# EAGLE schematic ABS converter (EAGLE 9.4.2)
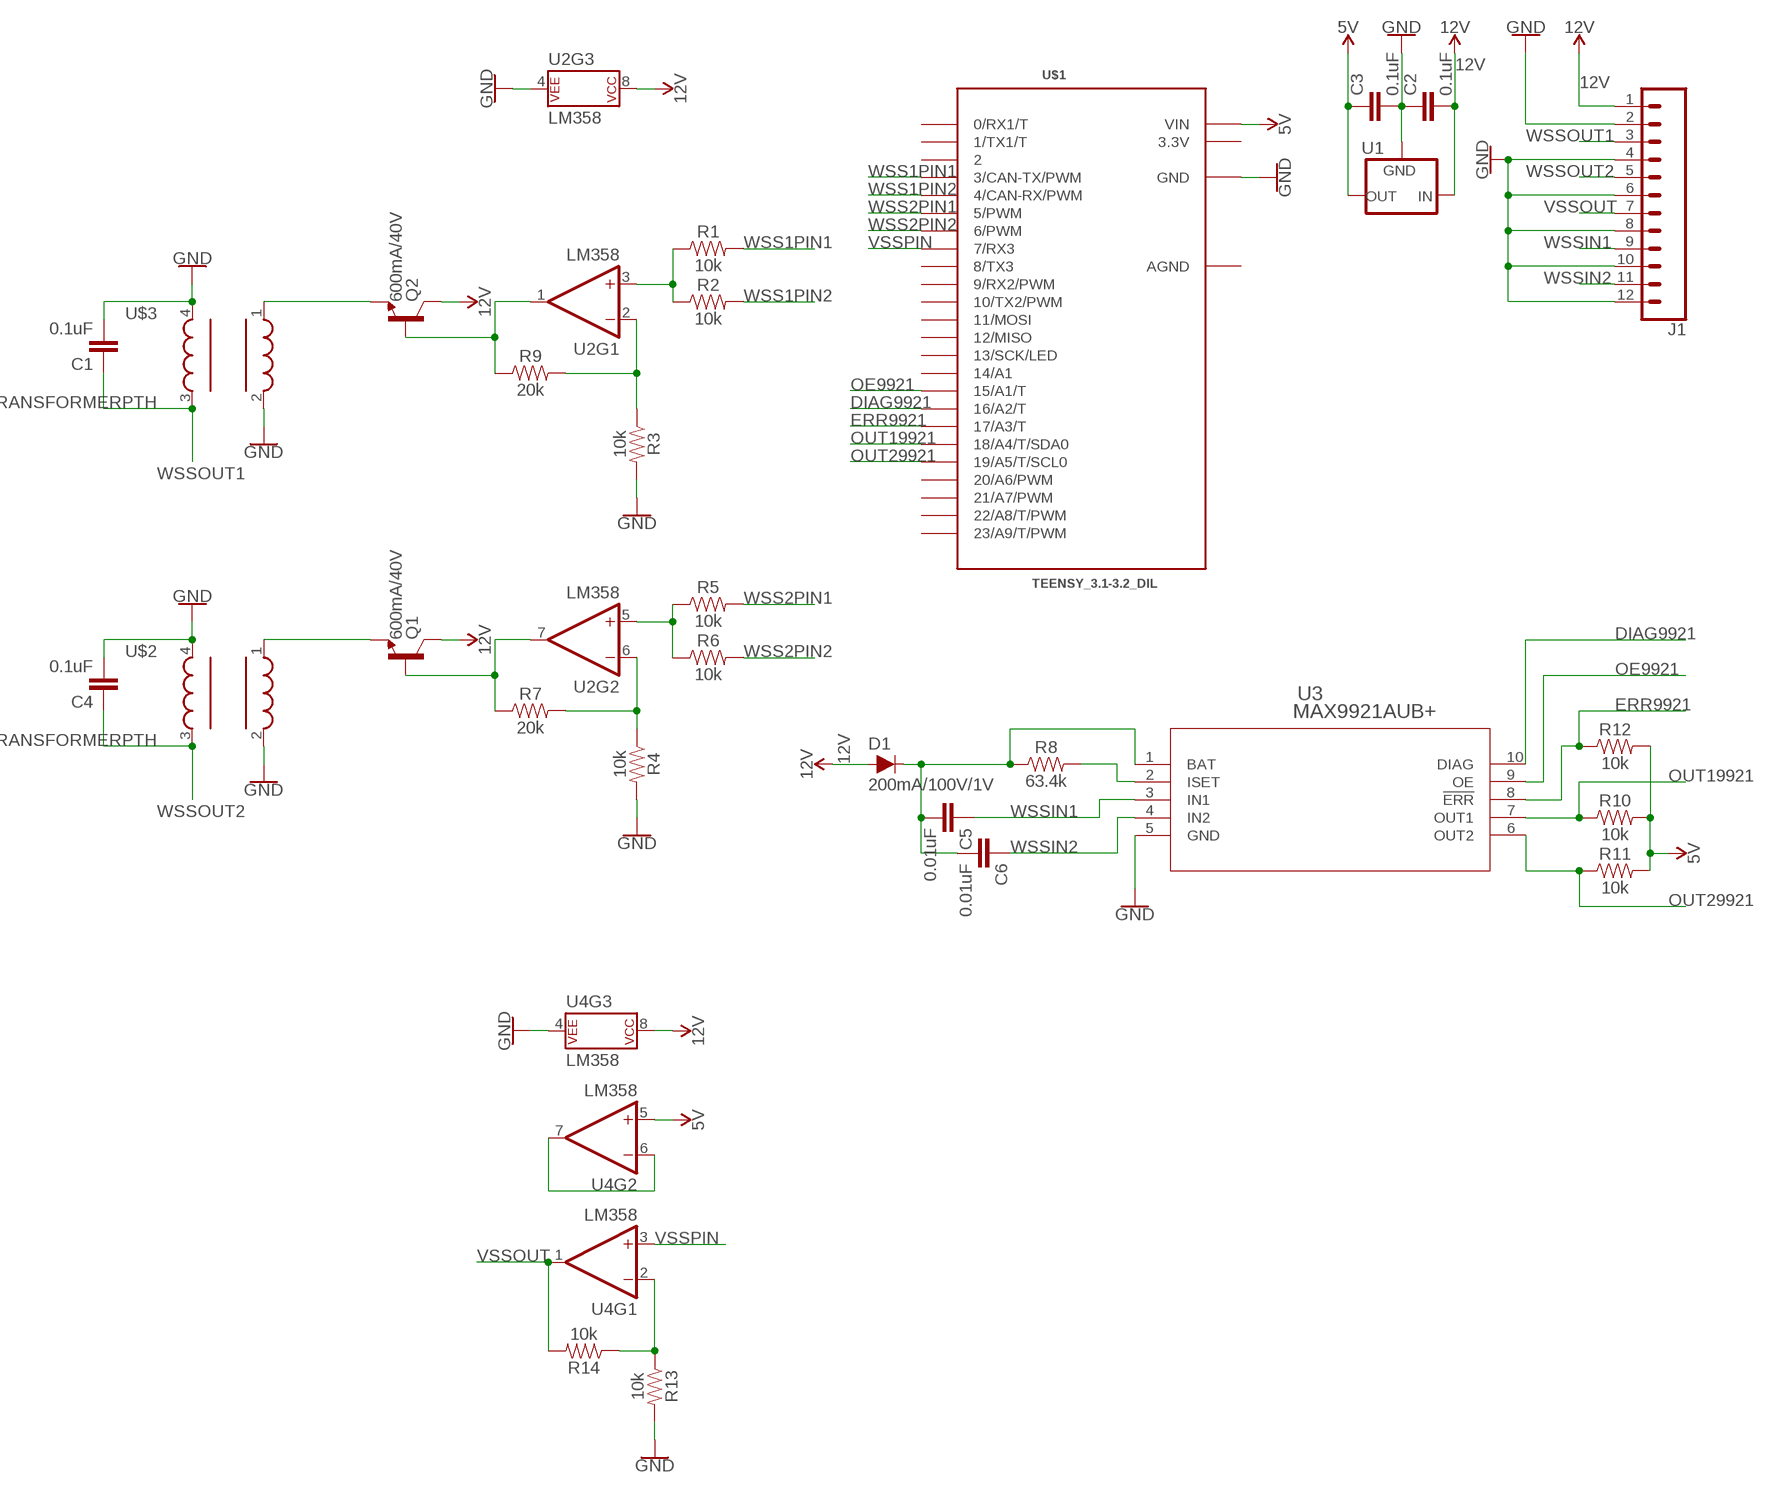
[diagram p0: schematic, sheet 1]

## Parts
C1  0.1uF  0.1UF-KIT-EZ-50V-20%  [CAP-PTH-SMALL-KIT]
C2  0.1uF  0.1UF-KIT-EZ-50V-20%  [CAP-PTH-SMALL-KIT]
C3  0.1uF  0.1UF-KIT-EZ-50V-20%  [CAP-PTH-SMALL-KIT]
C4  0.1uF  0.1UF-KIT-EZ-50V-20%  [CAP-PTH-SMALL-KIT]
C5  0.01uF  0.1UF-KIT-EZ-50V-20%  [CAP-PTH-SMALL-KIT]
C6  0.01uF  0.1UF-KIT-EZ-50V-20%  [CAP-PTH-SMALL-KIT]
D1  200mA/100V/1V  DIODE-1N4148  [DIODE-1N4148]
J1  CONN_12  [1X12]
Q1  600mA/40V  TRANS_NPN-P2N2222A  [TO-92]
Q2  600mA/40V  TRANS_NPN-P2N2222A  [TO-92]
R1  10k  10KOHM-HORIZ-1/4W-1%  [AXIAL-0.3]
R2  10k  10KOHM-HORIZ-1/4W-1%  [AXIAL-0.3]
R3  10k  10KOHM-HORIZ-1/4W-1%  [AXIAL-0.3]
R4  10k  10KOHM-HORIZ-1/4W-1%  [AXIAL-0.3]
R5  10k  10KOHM-HORIZ-1/4W-1%  [AXIAL-0.3]
R6  10k  10KOHM-HORIZ-1/4W-1%  [AXIAL-0.3]
R7  20k  RESISTORAXIAL-0.3  [AXIAL-0.3]
R8  63.4k  RESISTORAXIAL-0.3  [AXIAL-0.3]
R9  20k  RESISTORAXIAL-0.3  [AXIAL-0.3]
R10  10k  10KOHM-HORIZ-1/4W-1%  [AXIAL-0.3]
R11  10k  10KOHM-HORIZ-1/4W-1%  [AXIAL-0.3]
R12  10k  10KOHM-HORIZ-1/4W-1%  [AXIAL-0.3]
R13  10k  10KOHM-HORIZ-1/4W-1%  [AXIAL-0.3]
R14  10k  10KOHM-HORIZ-1/4W-1%  [AXIAL-0.3]
U1  V_REG_78XX-TO-220  [TO-220-ALT]
U2  LM358  [DIP08]
U3  MAX9921AUB+  [21-0061L]
U4  LM358  [DIP08]
U$1  TEENSY_3.1-3.2_DIL  [TEENSY_3.0-3.2&LC_DIL]
U$2  TRANSFORMERPTH  [TRANSFORMER]
U$3  TRANSFORMERPTH  [TRANSFORMER]

## Nets
5V: C3.1 R10.P$2 R11.P$2 R12.P$2 U1.OUT U4.5(+IN) U$1.VIN
12V: C2.2 D1.A J1.1 Q1.1(C) Q2.1(C) U1.IN U2.8(P$V+) U4.8(P$V+)
DIAG9921: U3.10(DIAG) U$1.16/A2(16/A2/T)
ERR9921: R12.P$1 U3.8(!ERR) U$1.17/A3(17/A3/T)
GND: C1.2 C2.1 C3.2 C4.2 J1.2 J1.4 J1.6 J1.8 J1.10 J1.12 R3.P$2 R4.P$2 R13.P$2 U1.GND U2.4(P$V-) U3.5(GND) U4.4(P$V-) U$1.GND U$2.2 U$2.4 U$3.2 U$3.4
N$3: Q2.2(B) R9.P$1 U2.1(OUT)
N$4: R1.P$1 R2.P$1 U2.3(+IN)
N$5: R3.P$1 R9.P$2 U2.2(-IN)
N$6: Q2.3(E) U$3.1
N$9: R5.P$1 R6.P$1 U2.5(+IN)
N$10: R4.P$1 R7.P$2 U2.6(-IN)
N$11: Q1.2(B) R7.P$1 U2.7(OUT)
N$12: Q1.3(E) U$2.1
N$13: R8.P$2 U3.2(ISET)
N$14: C5.2 C6.2 D1.C R8.P$1 U3.1(BAT)
N$15: U4.6(-IN) U4.7(OUT)
N$17: R13.P$1 R14.P$1 U4.2(-IN)
OE9921: U3.9(OE) U$1.15/A1(15/A1/T)
OUT19921: R10.P$1 U3.7(OUT1) U$1.18/A4(18/A4/T/SDA0)
OUT29921: R11.P$1 U3.6(OUT2) U$1.19/A5(19/A5/T/SCL0)
VSSOUT: J1.7 R14.P$2 U4.1(OUT)
VSSPIN: U4.3(+IN) U$1.7(7/RX3)
WSS1PIN1: R1.P$2 U$1.3(3/CAN-TX/PWM)
WSS1PIN2: R2.P$2 U$1.4(4/CAN-RX/PWM)
WSS2PIN1: R5.P$2 U$1.5(5/PWM)
WSS2PIN2: R6.P$2 U$1.6(6/PWM)
WSSIN1: C5.1 J1.9 U3.3(IN1)
WSSIN2: C6.1 J1.11 U3.4(IN2)
WSSOUT1: C1.1 J1.3 U$3.3
WSSOUT2: C4.1 J1.5 U$2.3
Unconnected: U$1.0(0/RX1/T) U$1.1(1/TX1/T) U$1.2 U$1.8(8/TX3) U$1.9(9/RX2/PWM) U$1.10(10/TX2/PWM) U$1.11(11/MOSI) U$1.12(12/MISO) U$1.13(13/SCK/LED) U$1.14/A0(14/A1) U$1.20/A6(20/A6/PWM) U$1.21/A7(21/A7/PWM) U$1.22/A8(22/A8/T/PWM) U$1.23/A9(23/A9/T/PWM)

## Power pins joined to a net without a drawn wire
3.3V: U$1.3.3V
AGND: U$1.AGND

## Library data of the parts
C1-C4 = SparkFun-Capacitors:0.1UF: 0.1µF ceramic capacitors A capacitor is a passive two-terminal electrical component used to store electrical energy temporarily in an electric field.; PROD_ID: CAP-08370
C5 C6 = SparkFun-Capacitors:0.1UF: 0.1µF ceramic capacitors A capacitor is a passive two-terminal electrical component used to store electrical energy temporarily in an electric field.; PROD_ID: CAP-08370; VALUE: 0.1uF
D1 = SparkFun-DiscreteSemi:DIODE: Diode These are standard reverse protection diodes and small signal diodes. SparkFun Products: SparkFun SparkPunk Sound Kit <https://www.sparkfun.com/products/11177> SparkFun ESP8266 Thing <https://www.sparkfun.com/products/13231>; PROD_ID: DIO-08378
J1 = SparkFun-Connectors:CONN_12: Multi connection point. Often used as Generic Header-pin footprint for 0.1 inch spaced/style header connections On any of the 0.1 inch spaced packages, you can populate with these: Break Away Headers - Straight <https://www.sparkfun.com/products/116> (PRT-00116) Break Away Male Headers - Right Angle <https://www.sparkfun.com/products/553> (PRT-00553) Female Headers <https://www.sparkfun.com/products/115> (PRT-00115) Break Away Headers - Machine Pin <https://www.sparkfun.com/products/117> (PRT-00117) Break Away Female Headers - Swiss Machine Pin <https://www.sparkfun.com/products/743> (PRT-00743) For SCREWTERMINALS and SPRING TERMINALS visit here: Screw Terimnals on SparkFun.com <https://www.sparkfun.com/search/results?term=Screw+Terminals> (5mm/3.5mm/2.54mm spacing) This device is also useful as a general connection point to wire up your design to another part of your project. Our various solder wires solder well into these plated through hole pads. Hook-Up Wire - Assortment (Stranded, 22 AWG) <https://www.sparkfun.com/products/11375> (PRT-11375) Hook-Up Wire - Assortment (Solid Core, 22 AWG) <https://www.sparkfun.com/products/11367> (PRT-11367) View the entire wire category on our website here <https://www.sparkfun.com/categories/141> Special notes: Molex polarized connector foot print use with SKU : PRT-08231 with associated crimp pins and housings. 1MM SMD Version SKU: PRT-10208 NOTES ON THE VARIANTS LOCK and LOCK_LONGPADS... This footprint was designed to help hold the alignment of a through-hole component (i.e. 6-pin header) while soldering it into place. You may notice that each hole has been shifted either up or down by 0.005 of an inch from it's more standard position (which is a perfectly straight line). This slight alteration caused the pins (the squares in the middle) to touch the edges of the holes. Because they are alternating, it causes a "brace" to hold the component in place. 0.005 has proven to be the perfect amount of "off-center" position when using our standard breakaway headers. Although looks a little odd when you look at the bare footprint, once you have a header in there, the alteration is very hard to notice. Also,if you push a header all the way into place, it is covered up entirely on the bottom side.
Q1 Q2 = SparkFun-DiscreteSemi:TRANS_NPN: NPN transistor Current controlled devices typically used to amplify current or used as a switch. BC547 - COM-08928 <http://www.sparkfun.com/products/8928> (TO-92 45V 100mA) (1.Collector 2.Base 3.Emitter) 2N3904 - COM-00521 <http://www.sparkfun.com/products/521> (TO-92 40V 200mA) (1.Emitter 2.Base 3.Collector) P2N2222A - COM-12852 <http://www.sparkfun.com/products/12852> (TO-92 40V 600mA) (1.Collector 2.Base 3.Emitter); PROD_ID: TRANS-09536
R1-R6 R10-R14 = SparkFun-Resistors:10KOHM: 10kΩ resistor A resistor is a passive two-terminal electrical component that implements electrical resistance as a circuit element. Resistors act to reduce current flow, and, at the same time, act to lower voltage levels within circuits. - Wikipedia; PROD_ID: RES-12183
R7-R9 = SparkFun-Resistors:RESISTOR: Generic Resistor Package
U1 = SparkFun-IC-Power:V_REG_78XX: Voltage Regulator Standard 78xx regulator. IGO (Input Ground Output). Spark Fun Electronics SKU : COM-00107; PROD_ID: VREG-08450; SF_ID: COM-00107
U2 U4 = SparkFun-IC-Amplifiers:LM358: LM358 Jellybean op-amp Datasheet <http://www.sparkfun.com/datasheets/Components/General/LM358.pdf> SparkFun Products Op-Amp (Thru-Hole) - LM358 <https://www.sparkfun.com/products/9456> (COM-09456); PROD_ID: IC-09172
U3 = Maxim integrated:MAX9921AUB+; MANUFACTURER_PART_NUMBER: MAX9921AUB+; VENDOR: Maxim Integrated Products
U$1 = Teensy_3_and_LC_Series_Boards_v1.4:TEENSY_3.1-3.2_DIL: Teensy 3.1 or 3.2 in a DIL Layout.
U$2 U$3 = SparkFun-Coils:TRANSFORMER: Small transformers

## Net classes
0 default: width 0.254 mm, drill 0.508 mm, clearance 0.127 mm